# EAGLE schematic chipchestra-v05-actuators (EAGLE 8.0.0)
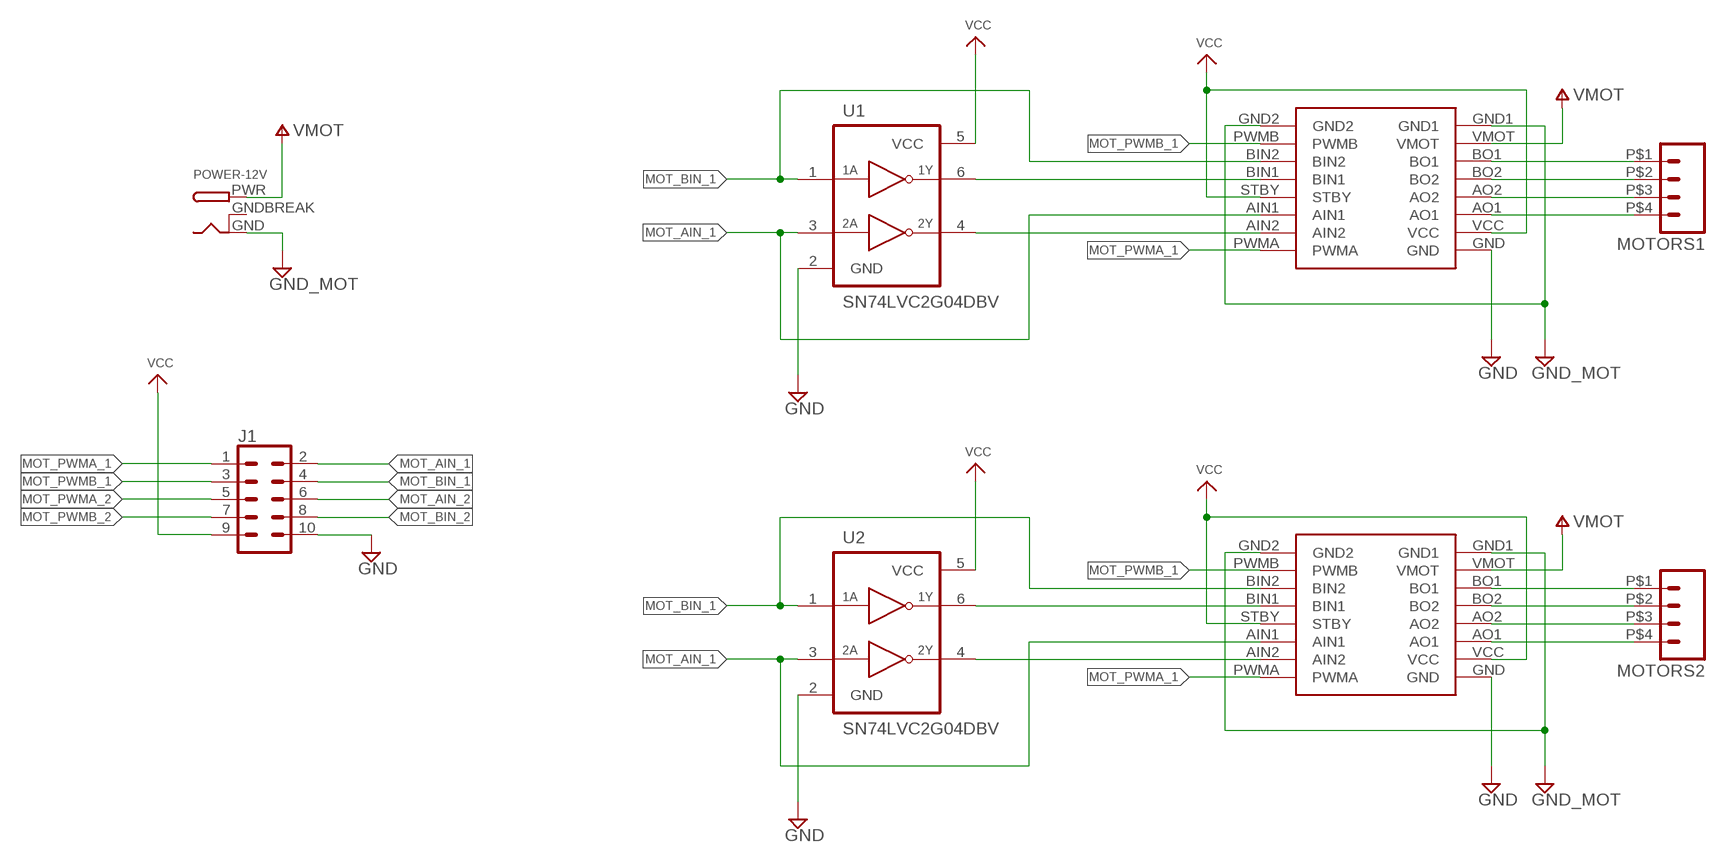
[diagram p0: schematic, sheet 1]

## Parts
J1  CONN_05X2SHD_LOCK  [2X5-SHROUDED_LOCK]
MOTORS1  M04  [SPRINGTERMINAL-2.54MM-4]
MOTORS2  M04  [SPRINGTERMINAL-2.54MM-4]
POWER-12V  DCBARRELPTH  [DCJACK_2MM_PTH]
U1  SN74LVC2G04DBV  [SOT23-6]
U2  SN74LVC2G04DBV  [SOT23-6]
U$1  POLOLU_TB6612FNG  [POLOLU_TB6612FNG]
U$7  POLOLU_TB6612FNG  [POLOLU_TB6612FNG]

## Nets
GND: J1.10 U1.2(GND) U2.2(GND) U$1.GND U$7.GND
GND_MOT [Power]: POWER-12V.GND U$1.GND1 U$1.GND2 U$7.GND1 U$7.GND2
MOT_AIN_1: J1.2 U1.3(2A) U2.3(2A) U$1.AIN1 U$7.AIN1
MOT_AIN_2: J1.6
MOT_BIN_1: J1.4 U1.1(1A) U2.1(1A) U$1.BIN2 U$7.BIN2
MOT_BIN_2: J1.8
MOT_PWMA_1: J1.1 U$1.PWMA U$7.PWMA
MOT_PWMA_2: J1.5
MOT_PWMB_1: J1.3 U$1.PWMB U$7.PWMB
MOT_PWMB_2: J1.7
N$1 [Power]: MOTORS2.P$1 U$1.BO1
N$2 [Power]: MOTORS2.P$2 U$1.BO2
N$3 [Power]: MOTORS2.P$3 U$1.AO2
N$4 [Power]: MOTORS2.P$4 U$1.AO1
N$5: U1.6(1Y) U$7.BIN1
N$6: U1.4(2Y) U$7.AIN2
N$7: U2.6(1Y) U$1.BIN1
N$8: U2.4(2Y) U$1.AIN2
N$45 [Power]: MOTORS1.P$1 U$7.BO1
N$46 [Power]: MOTORS1.P$2 U$7.BO2
N$52 [Power]: MOTORS1.P$3 U$7.AO2
N$54 [Power]: MOTORS1.P$4 U$7.AO1
VCC: J1.9 U1.5(VCC) U2.5(VCC) U$1.STBY U$1.VCC U$7.STBY U$7.VCC
VMOT [Power]: POWER-12V.PWR U$1.VMOT U$7.VMOT ; supply symbol labelled V+

## Power pins joined to a net without a drawn wire
GNDBREAK: POWER-12V.GNDBREAK

## Library data of the parts
J1 = SparkFun-Connectors:CONN_05X2: Multi connection point. Often used as Generic Header-pin footprint for 0.1 inch spaced/style header connections For AVR SPI programming port, see special device with nice symbol: "AVR_SPI_PROG_5x2.dev" You can populate with any combo of single row headers, but if you'd like an exact match, check these: 2x5 AVR ICSP Male Header <https://www.sparkfun.com/products/778> (PRT-00778) 2x5 Pin Shrouded Header <https://www.sparkfun.com/products/8506> (PRT-08506) On any of the 0.1 inch spaced packages, you can populate with these: Break Away Headers - Straight <https://www.sparkfun.com/products/116> (PRT-00116) Break Away Male Headers - Right Angle <https://www.sparkfun.com/products/553> (PRT-00553) Female Headers <https://www.sparkfun.com/products/115> (PRT-00115) Break Away Headers - Machine Pin <https://www.sparkfun.com/products/117> (PRT-00117) Break Away Female Headers - Swiss Machine Pin <https://www.sparkfun.com/products/743> (PRT-00743) Special note: the shrouded connector mates well with our 5x2 ribbon cables: 2x5 Pin IDC Ribbon Cable <https://www.sparkfun.com/products/8535> (PRT-08535); PROD_ID: CONN-08671; SF_ID: PRT-08506
MOTORS1 MOTORS2 = CMU-ArtFab:M04: Header 4 Standard 4-pin 0.1" header. Use with straight break away headers (SKU : PRT-00116), right angle break away headers (PRT-00553), swiss pins (PRT-00743), machine pins (PRT-00117), and female headers (PRT-00115). Molex polarized connector foot print use with SKU : PRT-08231 with associated crimp pins and housings. 1MM SMD Version SKU: PRT-10208
POWER-12V = adafruit:DCBARREL: 2.0mm DC Barrel Jack DCJACK_2MM_PTH - Through Hole Jack (4UConnector: 05537)
U1 U2 = 74LV:SN74LVC2G04: DUAL INVERTER GATE
U$1 U$7 = CMU-ArtFab:POLOLU_TB6612FNG

## Net classes
0 default: width 0.305 mm, clearance 0.152 mm
1 GND: width 0.508 mm, clearance 0.152 mm
2 Power: width 0.508 mm, clearance 0.152 mm